# EAGLE design Esquematico (EAGLE 5.06)
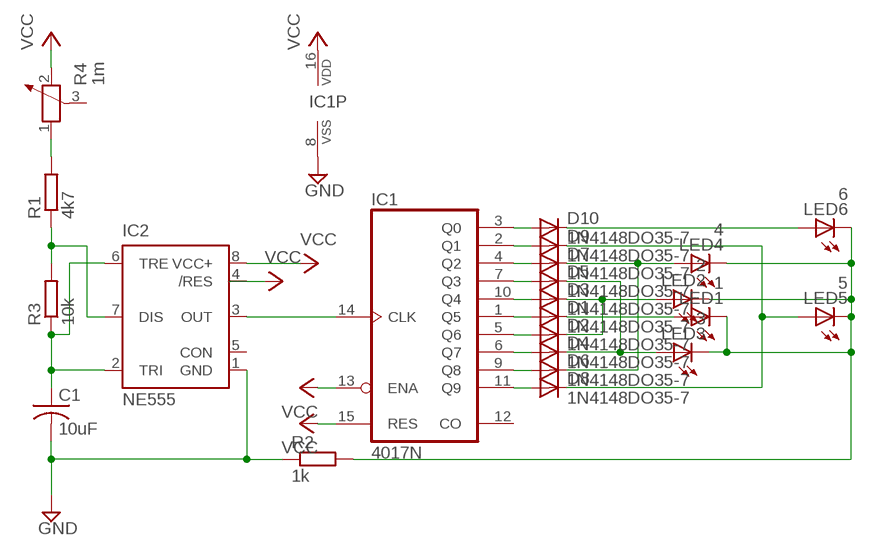
[diagram p0: schematic, sheet 1]

## Parts
C1  10uF  C-US025-024X044  [C025-024X044]
D1  1N4148DO35-7  [DO35-7]
D2  1N4148DO35-7  [DO35-7]
D3  1N4148DO35-7  [DO35-7]
D4  1N4148DO35-7  [DO35-7]
D5  1N4148DO35-7  [DO35-7]
D6  1N4148DO35-7  [DO35-7]
D7  1N4148DO35-7  [DO35-7]
D8  1N4148DO35-7  [DO35-7]
D9  1N4148DO35-7  [DO35-7]
D10  1N4148DO35-7  [DO35-7]
IC1  4017N  [DIL16]
IC2  NE555  [DIL-08]
LED1  1  LED5MM  [LED5MM]
LED2  2  LED5MM  [LED5MM]
LED3  3  LED5MM  [LED5MM]
LED4  4  LED5MM  [LED5MM]
LED5  5  LED5MM  [LED5MM]
LED6  6  LED5MM  [LED5MM]
R1  4k7  R-EU_0204/7  [0204/7]
R2  1k  R-EU_0204/7  [0204/7]
R3  10k  R-EU_0204/7  [0204/7]
R4  1m  POTENTIOMETER_PT-10  [PT-10]

## Nets
GND: C1.2 IC1.8(VSS) IC2.1(GND) R2.1
N$1: D10.A IC1.3(Q0)
N$2: D9.A IC1.2(Q1)
N$3: D7.A IC1.4(Q2)
N$4: D5.A IC1.7(Q3)
N$5: D3.A IC1.10(Q4)
N$6: D1.A IC1.1(Q5)
N$7: D2.A IC1.5(Q6)
N$8: D4.A IC1.6(Q7)
N$9: D6.A IC1.9(Q8)
N$10: D8.A IC1.11(Q9)
N$11: D1.C LED1.A
N$12: D2.C D3.C LED2.A
N$13: D4.C D5.C LED3.A
N$14: D6.C D7.C LED4.A
N$15: D8.C D9.C LED5.A
N$16: D10.C LED6.A
N$17: IC1.14(CLK) IC2.3(OUT)
N$18: LED1.K(C) LED2.K(C) LED3.K(C) LED4.K(C) LED5.K(C) LED6.K(C) R2.2
N$19: IC2.7(DIS) R1.1 R3.2
N$20: C1.1 IC2.2(TRI) IC2.6(TRE) R3.1
N$21: R1.2 R4.1
VCC: IC1.13(ENA) IC1.15(RES) IC1.16(VDD) IC2.8(VCC+) R4.2
Unconnected: IC1.12(CO) IC2.4(/RES) IC2.5(CON) R4.3

## Library data of the parts
C1 = rcl:C-US: CAPACITOR, American symbol
D1-D10 = diode:1N4148: DIODE high speed (Philips)
IC1 = 40xx:4017: COUNTER/DIVIDER
IC2 = st-microelectronics:NE555: General purpose bipolar Timer
LED1-LED6 = led:LED: LED OSRAM: - CHIPLED LG R971, LG N971, LY N971, LG Q971, LY Q971, LO R971, LY R971 LH N974, LH R974 LS Q976, LO Q976, LY Q976 LO Q996 - Hyper CHIPLED LW Q18S LB Q993, LB Q99A, LB R99A - SideLED LS A670, LO A670, LY A670, LG A670, LP A670 LB A673, LV A673, LT A673, LW A673 LH A674 LY A675 LS A676, LA A676, LO A676, LY A676, LW A676 LS A679, LY A679, LG A679 - Hyper Micro SIDELED® LS Y876, LA Y876, LO Y876, LY Y876 LT Y87S - SmartLED LW L88C, LW L88S LB L89C, LB L89S, LG L890 LS L89K, LO L89K, LY L89K LS L896, LA L896, LO L896, LY L896 - TOPLED LS T670, LO T670, LY T670, LG T670, LP T670 LSG T670, LSP T670, LSY T670, LOP T670, LYG T670 LG T671, LOG T671, LSG T671 LB T673, LV T673, LT T673, LW T673 LH T674 LS T676, LA T676, LO T676, LY T676, LB T676, LH T676, LSB T676, LW T676 LB T67C, LV T67C, LT T67C, LS T67K, LO T67K, LY T67K, LW E67C LS E67B, LA E67B, LO E67B, LY E67B, LB E67C, LV E67C, LT E67C LW T67C LS T679, LY T679, LG T679 LS T770, LO T770, LY T770, LG T770, LP T770 LB T773, LV T773, LT T773, LW T773 LH T774 LS E675, LA E675, LY E675, LS T675 LS T776, LA T776, LO T776, LY T776, LB T776 LHGB T686 LT T68C, LB T68C - Hyper Mini TOPLED® LB M676 - Mini TOPLED Santana® LG M470 LS M47K, LO M47K, LY M47K Source: http://www.osram.convergy.de LUXEON: - LUMILED® LXK2-PW12-R00, LXK2-PW12-S00, LXK2-PW14-U00, LXK2-PW14-V00 LXK2-PM12-R00, LXK2-PM12-S00, LXK2-PM14-U00 LXK2-PE12-Q00, LXK2-PE12-R00, LXK2-PE12-S00, LXK2-PE14-T00, LXK2-PE14-U00 LXK2-PB12-K00, LXK2-PB12-L00, LXK2-PB12-M00, LXK2-PB14-N00, LXK2-PB14-P00, LXK2-PB14-Q00 LXK2-PR12-L00, LXK2-PR12-M00, LXK2-PR14-Q00, LXK2-PR14-R00 LXK2-PD12-Q00, LXK2-PD12-R00, LXK2-PD12-S00 LXK2-PH12-R00, LXK2-PH12-S00 LXK2-PL12-P00, LXK2-PL12-Q00, LXK2-PL12-R00 Source: www.luxeon.com KINGBRIGHT: KA-3528ASYC Source: www.kingbright.com
R1-R3 = rcl:R-EU_: RESISTOR, European symbol
R4 = rcl:POTENTIOMETER_: Potentiometer

## Board
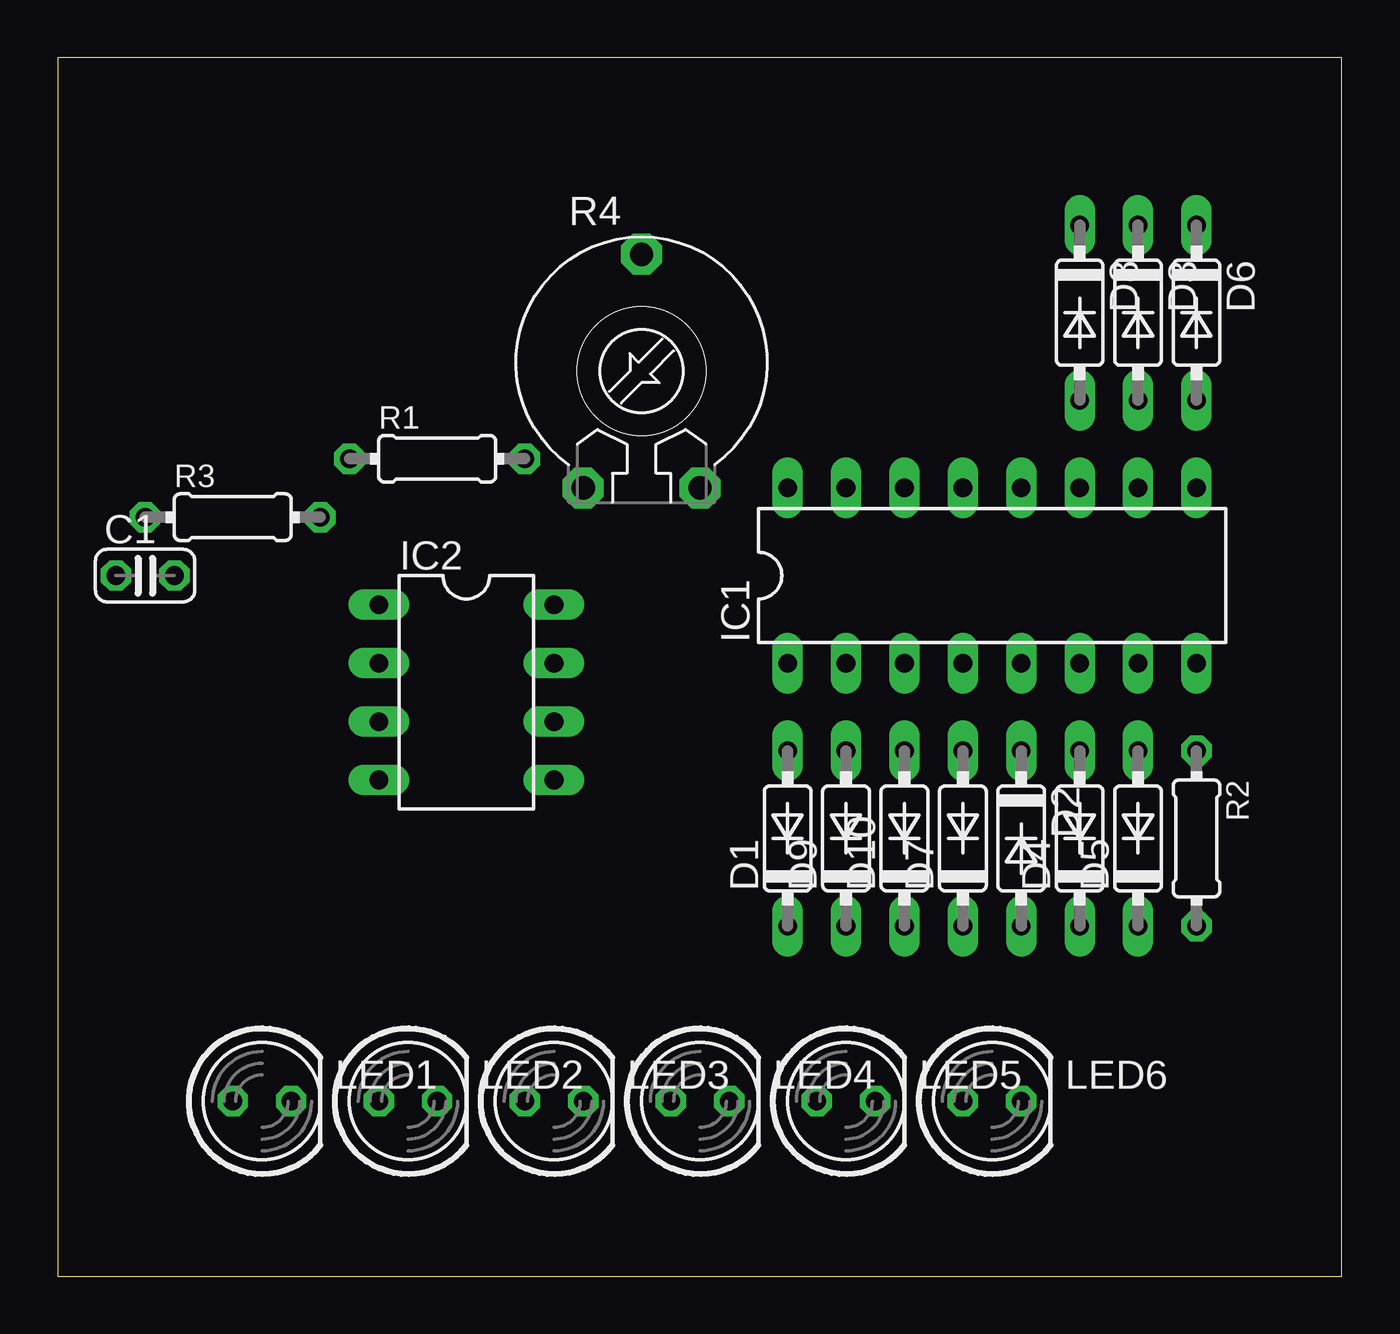
[diagram p1: board, top side]
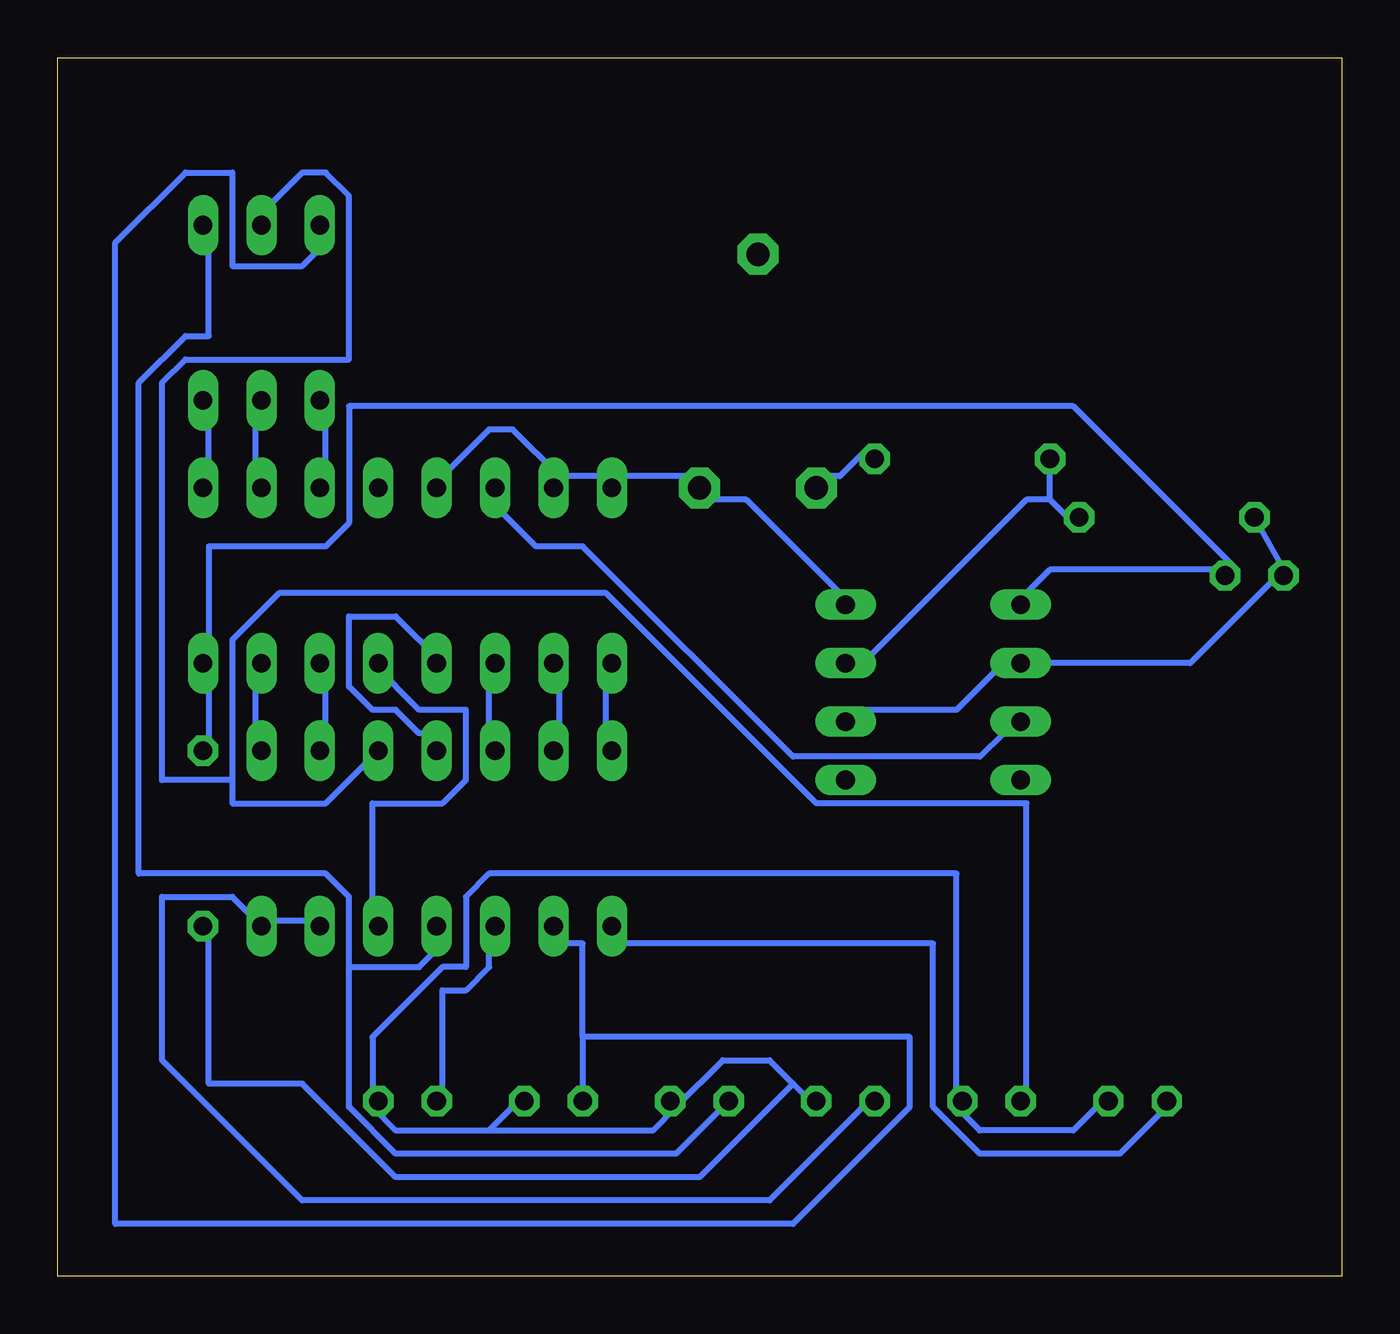
[diagram p2: board, bottom side, seen from below]

Size 55.86 x 53.01 mm. Coordinates in mm from the lower left corner, seen from the top.
Outline: 0,0 55.86,0 55.86,53.01 0,53.01 0,0
Copper layers (1*16): Top 0.035mm / dielectric 1.5mm / Bottom 0.035mm
Design rules "default": minimum track width 10mil, minimum drill 24mil, track to track 8mil, track to pad 8mil, pad to pad 8mil, via to via 8mil, smd to smd 8mil, copper to edge 40mil, drill to drill 8mil, minimum pad ring 10mil, minimum via ring 8mil, stop-mask expansion 4mil, vias tented up to drill 0mil, thermal gap 10mil

### Footprints (pad centres in the part's own frame; a part is rotated, then mirrored left to right if it is on the bottom)
C025-024X044 = drill 0.813 octagon: 1 -1.27,0; 2 1.27,0
DO35-7 = drill 0.813 long: A 3.81,0; C -3.81,0
DIL16 = drill 0.813 long: 1 -8.89,-3.81; 2 -6.35,-3.81; 3 -3.81,-3.81; 4 -1.27,-3.81; 5 1.27,-3.81; 6 3.81,-3.81; 7 6.35,-3.81; 8 8.89,-3.81; 9 8.89,3.81; 10 6.35,3.81; 11 3.81,3.81; 12 1.27,3.81; 13 -1.27,3.81; 14 -3.81,3.81; 15 -6.35,3.81; 16 -8.89,3.81
DIL-08 = drill 0.813 long: 1 -3.81,-3.81; 2 -1.27,-3.81; 3 1.27,-3.81; 4 3.81,-3.81; 5 3.81,3.81; 6 1.27,3.81; 7 -1.27,3.81; 8 -3.81,3.81
LED5MM = drill 0.813 octagon: A -1.27,0; K 1.27,0
0204/7 = drill 0.813 octagon: 1 -3.81,0; 2 3.81,0
PT-10 = drill 1.016 pad 1.778 octagon: 1 -2.54,-5.08; 2 2.54,-5.08; 3 0,5.08

### Placement (x,y rotation side)
C1  3.81,30.48 0 top
D1  31.75,19.05 90 top
D2  41.91,19.05 270 top
D3  46.99,41.91 270 top
D4  44.45,19.05 90 top
D5  46.99,19.05 90 top
D6  49.53,41.91 270 top
D7  39.37,19.05 90 top
D8  44.45,41.91 270 top
D9  34.29,19.05 90 top
D10  36.83,19.05 90 top
IC1  40.64,30.48 0 top
IC2  17.78,25.4 270 top
LED1  8.89,7.62 0 top
LED2  15.24,7.62 0 top
LED3  21.59,7.62 0 top
LED4  27.94,7.62 0 top
LED5  34.29,7.62 0 top
LED6  40.64,7.62 0 top
R1  16.51,35.56 0 top
R2  49.53,19.05 270 top
R3  7.62,33.02 0 top
R4  25.4,39.37 0 top

### Tracks (layer width: path | path; a pad name or v marks a point on that pad's centre or on a via)
GND
  Bottom 0.254: 49.28,26.67 49.28,22.61 R2.1 | IC2.1 13.72,29.72 12.7,30.73 5.59,30.73 C1.2 4.57,30.73 11.68,37.85 43.18,37.85 43.18,32.77 44.2,31.75 49.28,31.75 49.28,26.67 | 49.28,26.67 IC1.8
N$1
  Bottom 0.254: D10.A 37.08,23.62 37.08,26.67 IC1.3
N$2
  Bottom 0.254: D9.A 34.04,23.62 34.04,26.67 IC1.2
N$3
  Bottom 0.254: D7.A 39.12,23.62 40.13,23.62 41.15,24.64 42.16,24.64 43.18,25.65 43.18,28.7 41.15,28.7 39.12,26.67 IC1.4
N$4
  Bottom 0.254: D5.A 47.24,23.62 47.24,26.67 IC1.7
N$5
  Bottom 0.254: IC1.10 47.24,34.8 47.24,37.85 D3.A
N$6
  Bottom 0.254: D1.A 32,23.62 32,26.67 IC1.1
N$7
  Bottom 0.254: D2.A 42.16,15.49 42.16,20.57 39.12,20.57 38.1,21.59 38.1,24.64 40.13,24.64 42.16,26.67 IC1.5
N$8
  Bottom 0.254: D4.A 44.2,23.62 44.2,26.67 IC1.6
N$9
  Bottom 0.254: IC1.9 49.28,34.8 49.28,37.85 D6.A
N$10
  Bottom 0.254: IC1.11 44.2,34.8 44.2,37.85 D8.A
N$11
  Bottom 0.254: LED1.A 7.62,7.37 9.65,5.33 15.75,5.33 17.78,7.37 17.78,14.48 32,14.48 D1.C
N$12
  Bottom 0.254: 48.26,21.59 48.26,20.57 44.2,20.57 D2.C | 48.26,21.59 48.26,27.69 46.23,29.72 32,29.72 22.86,20.57 13.72,20.57 13.72,7.37 LED2.A | 48.26,21.59 51.31,21.59 51.31,38.86 50.29,39.88 43.18,39.88 43.18,46.99 44.2,48.01 45.21,48.01 47.24,45.97 D3.C
N$13
  Bottom 0.254: 47.24,15.49 48.26,16.51 51.31,16.51 51.31,9.4 45.21,3.3 24.89,3.3 20.83,7.37 LED3.A | 47.24,15.49 44.2,15.49 D4.C | 47.24,15.49 D5.C
N$14
  Bottom 0.254: 43.18,13.46 43.18,7.37 41.15,5.33 28.96,5.33 LED4.A | 43.18,13.46 40.13,13.46 39.12,14.48 D7.C | 43.18,13.46 43.18,16.51 44.2,17.53 52.32,17.53 52.32,38.86 50.29,40.89 49.28,40.89 49.28,44.96 D6.C
N$15
  Bottom 0.254: 33.02,10.41 33.02,14.48 34.04,14.48 D9.C | 33.02,10.41 LED5.A 33.02,7.37 | 33.02,10.41 18.8,10.41 18.8,7.37 23.88,2.29 53.34,2.29 53.34,44.96 50.29,48.01 48.26,48.01 48.26,43.94 45.21,43.94 44.2,44.96 D8.C
N$16
  Bottom 0.254: LED6.A 39.12,7.37 39.12,12.45 38.1,12.45 37.08,13.46 37.08,14.48 D10.C
N$17
  Bottom 0.254: IC2.3 14.73,23.62 15.75,22.61 23.88,22.61 33.02,31.75 35.05,31.75 37.08,33.78 IC1.14
N$18
  Bottom 0.254: 23.88,8.38 24.89,9.4 26.92,9.4 28.96,7.37 | 23.88,8.38 22.86,7.37 LED3.K | 23.88,8.38 27.94,4.32 41.15,4.32 45.21,8.38 49.28,8.38 49.28,15.49 R2.2 | 16.76,7.37 15.75,6.35 11.68,6.35 10.67,7.37 LED1.K | 37.08,6.35 36.07,7.37 LED5.K | 37.08,6.35 41.15,6.35 42.16,7.37 | 16.76,7.37 16.76,17.53 37.08,17.53 38.1,16.51 38.1,13.46 39.12,13.46 42.16,10.41 42.16,7.37 | 16.76,7.37 LED2.K | 42.16,7.37 LED6.K | 28.96,7.37 29.97,6.35 37.08,6.35 | 28.96,7.37 LED4.K
N$19
  Bottom 0.254: 12.7,33.78 13.72,33.78 20.83,26.67 IC2.7 | 12.7,33.78 R1.1 | 12.7,33.78 11.68,32.77 R3.2
N$20
  Bottom 0.254: 2.54,30.73 R3.1 | IC2.6 20.83,24.64 16.76,24.64 14.73,26.67 IC2.2 6.6,26.67 2.54,30.73 | C1.1 2.54,30.73
N$21
  Bottom 0.254: R1.2 20.83,35.81 21.84,34.8 22.86,34.8 R4.1
VCC
  Bottom 0.254: 32,34.8 34.04,34.8 | 34.04,34.8 36.07,36.83 37.08,36.83 39.12,34.8 IC1.13 | 34.04,34.8 IC1.15 | IC2.8 21.84,29.72 25.91,33.78 27.94,33.78 R4.2 27.94,34.8 32,34.8 | 32,34.8 IC1.16